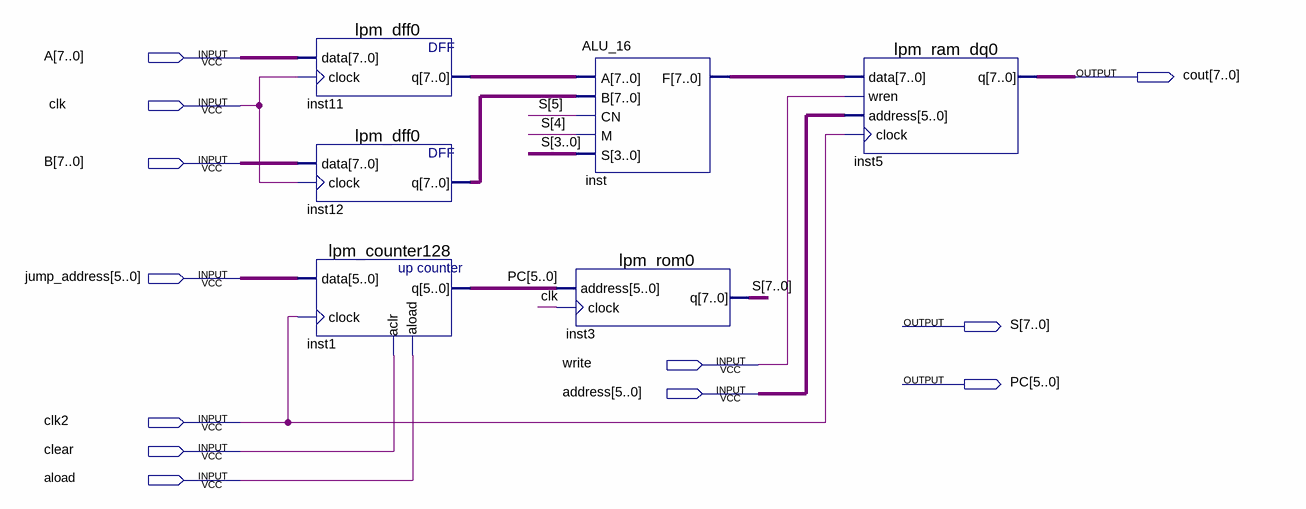
[diagram p0: schematic sheet]
// Quartus schematic CPU_8bit.bdf as structural Verilog: 6 symbols, 12 pins
module CPU_8bit (
  input  [7:0] A,
  input  clk,
  input  [7:0] B,
  input  [5:0] jump_address,
  input  write,
  input  [5:0] address,
  input  clk2,
  input  clear,
  input  aload,
  output [7:0] cout,
  output [7:0] S,
  output [5:0] PC
);

  wire [7:0] inst11_q, inst12_q, inst_f;

  lpm_dff0 inst11 (.data(A), .clock(clk), .q(inst11_q));
  lpm_dff0 inst12 (.data(B), .clock(clk), .q(inst12_q));
  lpm_counter128 inst1 (.data(jump_address), .clock(clk2), .aclr(clear), .aload(aload), .q(PC));
  ALU_16 inst (.A(inst11_q), .B(inst12_q), .CN(S[5]), .M(S[4]), .S(S[3:0]), .F(inst_f));
  lpm_rom0 inst3 (.address(PC), .clock(clk), .q(S));
  lpm_ram_dq0 inst5 (.data(inst_f), .wren(write), .address(address), .clock(clk2), .q(cout));
endmodule
